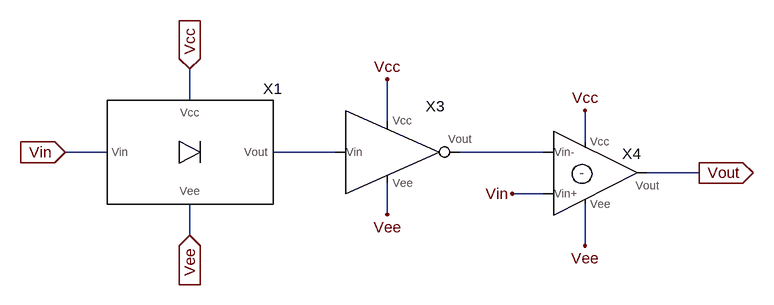
[diagram p0: schematic PraezisionsVollweggleichrichter_Variante_Subtrahierer.asc]
PraezisionsVollweggleichrichter_Variante_Subtrahierer.asc, the LTspice schematic file:
Version 4
SHEET 1 1296 680
WIRE 64 48 64 0
WIRE 368 80 368 16
WIRE 672 112 672 64
WIRE -64 128 -128 128
WIRE 288 128 192 128
WIRE 608 128 480 128
WIRE 848 160 768 160
WIRE 608 192 560 192
WIRE 368 224 368 176
WIRE 64 256 64 208
WIRE 672 272 672 208
FLAG 64 0 Vcc
IOPIN 64 0 In
FLAG 64 256 Vee
IOPIN 64 256 In
FLAG -128 128 Vin
IOPIN -128 128 In
FLAG 672 272 Vee
FLAG 672 64 Vcc
FLAG 560 192 Vin
FLAG 368 16 Vcc
FLAG 368 224 Vee
FLAG 848 160 Vout
IOPIN 848 160 Out
SYMBOL PraezEinwegGleichrichter 64 128 R0
SYMATTR InstName X1
SYMATTR SpiceLine k=2
SYMBOL InverterOp 368 128 R0
SYMATTR InstName X3
SYMBOL Subtrahierer 688 160 R0
SYMATTR InstName X4

The netlist it stands for:
* PraezisionsVollweggleichrichter_Variante_Subtrahierer.asc
XX1 Vcc Vee Vin N001 PraezEinwegGleichrichter k=2  ; pins Vcc Vee Vin Vout
XX3 Vcc Vee N001 N002 InverterOp  ; pins Vcc Vee Vin Vout
XX4 Vcc Vee Vin N002 Vout Subtrahierer  ; pins Vcc Vee Vin+ Vin- Vout
.backanno
.end